# EAGLE schematic Bus V3.0 (EAGLE 9.6.2)
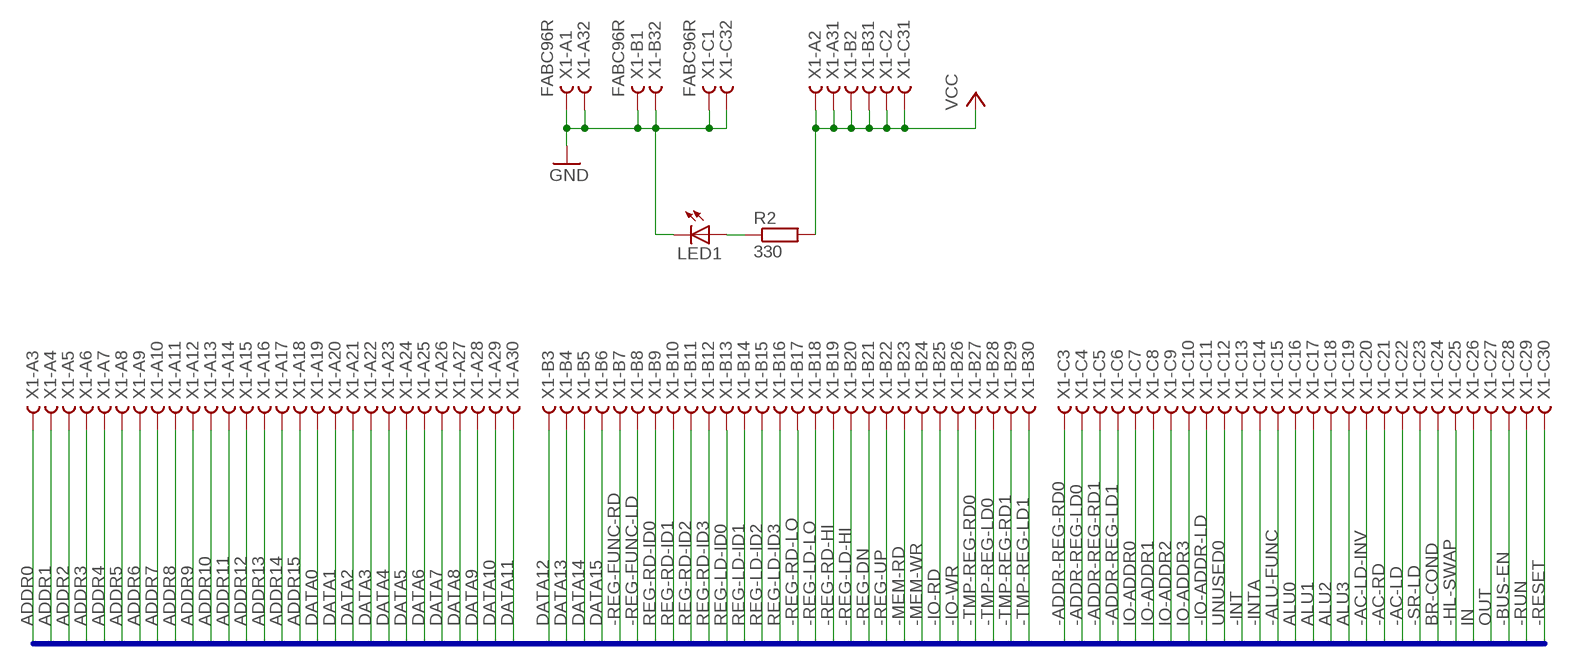
[diagram p0: schematic, sheet 1]

## Parts
LED1  LED5MM  [LED5MM]
R2  330  R0207/10  [0207/10]
X1  FABC96R  [FABC96R]

## Nets
-AC-LD: X1.C22
-AC-LD-INV: X1.C20
-AC-RD: X1.C21
-ADDR-REG-LD0: X1.C4
-ADDR-REG-LD1: X1.C6
-ADDR-REG-RD0: X1.C3
-ADDR-REG-RD1: X1.C5
-ALU-FUNC: X1.C15
-BUS-EN: X1.C28
-HL-SWAP: X1.C25
-INT: X1.C13
-INTA: X1.C14
-IO-ADDR-LD: X1.C11
-IO-RD: X1.B25
-IO-WR: X1.B26
-MEM-RD: X1.B23
-MEM-WR: X1.B24
-REG-DN: X1.B21
-REG-FUNC-LD: X1.B8
-REG-FUNC-RD: X1.B7
-REG-LD-HI: X1.B20
-REG-LD-LO: X1.B18
-REG-RD-HI: X1.B19
-REG-RD-LO: X1.B17
-REG-UP: X1.B22
-RESET: X1.C30
-RUN: X1.C29
-SR-LD: X1.C23
-TMP-REG-LD0: X1.B28
-TMP-REG-LD1: X1.B30
-TMP-REG-RD0: X1.B27
-TMP-REG-RD1: X1.B29
ADDR0: X1.A3
ADDR1: X1.A4
ADDR2: X1.A5
ADDR3: X1.A6
ADDR4: X1.A7
ADDR5: X1.A8
ADDR6: X1.A9
ADDR7: X1.A10
ADDR8: X1.A11
ADDR9: X1.A12
ADDR10: X1.A13
ADDR11: X1.A14
ADDR12: X1.A15
ADDR13: X1.A16
ADDR14: X1.A17
ADDR15: X1.A18
ALU0: X1.C16
ALU1: X1.C17
ALU2: X1.C18
ALU3: X1.C19
BR-COND: X1.C24
DATA0: X1.A19
DATA1: X1.A20
DATA2: X1.A21
DATA3: X1.A22
DATA4: X1.A23
DATA5: X1.A24
DATA6: X1.A25
DATA7: X1.A26
DATA8: X1.A27
DATA9: X1.A28
DATA10: X1.A29
DATA11: X1.A30
DATA12: X1.B3
DATA13: X1.B4
DATA14: X1.B5
DATA15: X1.B6
GND: LED1.K(C) X1.A1 X1.A32 X1.B1 X1.B32 X1.C1 X1.C32
IN: X1.C26
IO-ADDR0: X1.C7
IO-ADDR1: X1.C8
IO-ADDR2: X1.C9
IO-ADDR3: X1.C10
N$5: LED1.A R2.1
OUT: X1.C27
REG-LD-ID0: X1.B13
REG-LD-ID1: X1.B14
REG-LD-ID2: X1.B15
REG-LD-ID3: X1.B16
REG-RD-ID0: X1.B9
REG-RD-ID1: X1.B10
REG-RD-ID2: X1.B11
REG-RD-ID3: X1.B12
UNUSED0: X1.C12
VCC: R2.2 X1.A2 X1.A31 X1.B2 X1.B31 X1.C2 X1.C31

## Buses
-AC-LD,-AC-LD-INV,-AC-RD,ADDR[0..15],-ADDR-REG-LD[0..1],-ADDR-REG-RD[0..1],ALU[0..3],-ALU-FUNC,BR-COND,-BUS-EN,DATA[0..15],-HL-SWAP,IN,-INT,-INTA,IO-ADDR[0..3],-IO-ADDR-LD,-IO-RD,-IO-WR,-MEM-RD,-MEM-WR,OUT,-REG-DN,-REG-FUNC-LD,-REG-FUNC-RD,-REG-LD-HI,REG-LD-ID[0..3],-REG-LD-LO,-REG-RD-HI,REG-RD-ID[0..3],-REG-RD-LO,-REG-UP,-RESET,-RUN,-SR-LD,-TMP-REG-LD[0..1],-TMP-REG-RD[0..1],UNUSED0

## Library data of the parts
LED1 = led:LED: LED OSRAM: - CHIPLED LG R971, LG N971, LY N971, LG Q971, LY Q971, LO R971, LY R971 LH N974, LH R974 LS Q976, LO Q976, LY Q976 LO Q996 - Hyper CHIPLED LW Q18S LB Q993, LB Q99A, LB R99A - SideLED LS A670, LO A670, LY A670, LG A670, LP A670 LB A673, LV A673, LT A673, LW A673 LH A674 LY A675 LS A676, LA A676, LO A676, LY A676, LW A676 LS A679, LY A679, LG A679 - Hyper Micro SIDELED® LS Y876, LA Y876, LO Y876, LY Y876 LT Y87S - SmartLED LW L88C, LW L88S LB L89C, LB L89S, LG L890 LS L89K, LO L89K, LY L89K LS L896, LA L896, LO L896, LY L896 - TOPLED LS T670, LO T670, LY T670, LG T670, LP T670 LSG T670, LSP T670, LSY T670, LOP T670, LYG T670 LG T671, LOG T671, LSG T671 LB T673, LV T673, LT T673, LW T673 LH T674 LS T676, LA T676, LO T676, LY T676, LB T676, LH T676, LSB T676, LW T676 LB T67C, LV T67C, LT T67C, LS T67K, LO T67K, LY T67K, LW E67C LS E67B, LA E67B, LO E67B, LY E67B, LB E67C, LV E67C, LT E67C LW T67C LS T679, LY T679, LG T679 LS T770, LO T770, LY T770, LG T770, LP T770 LB T773, LV T773, LT T773, LW T773 LH T774 LS E675, LA E675, LY E675, LS T675 LS T776, LA T776, LO T776, LY T776, LB T776 LHGB T686 LT T68C, LB T68C - Hyper Mini TOPLED® LB M676 - Mini TOPLED Santana® LG M470 LS M47K, LO M47K, LY M47K Source: http://www.osram.convergy.de LUXEON: - LUMILED® LXK2-PW12-R00, LXK2-PW12-S00, LXK2-PW14-U00, LXK2-PW14-V00 LXK2-PM12-R00, LXK2-PM12-S00, LXK2-PM14-U00 LXK2-PE12-Q00, LXK2-PE12-R00, LXK2-PE12-S00, LXK2-PE14-T00, LXK2-PE14-U00 LXK2-PB12-K00, LXK2-PB12-L00, LXK2-PB12-M00, LXK2-PB14-N00, LXK2-PB14-P00, LXK2-PB14-Q00 LXK2-PR12-L00, LXK2-PR12-M00, LXK2-PR14-Q00, LXK2-PR14-R00 LXK2-PD12-Q00, LXK2-PD12-R00, LXK2-PD12-S00 LXK2-PH12-R00, LXK2-PH12-S00 LXK2-PL12-P00, LXK2-PL12-Q00, LXK2-PL12-R00 Source: www.luxeon.com KINGBRIGHT: KA-3528ASYC Source: www.kingbright.com
R2 = eagle-ltspice:R: RESISTOR, European symbol; SPICEMODEL: NONE; SPICEPREFIX: R
X1 = con-vg:FABC96R: CONNECTOR female, 96 pins, type R, rows ABC, grid 2.54 mm